# EAGLE design gameboy-pocket-custom (EAGLE 8.5.0)
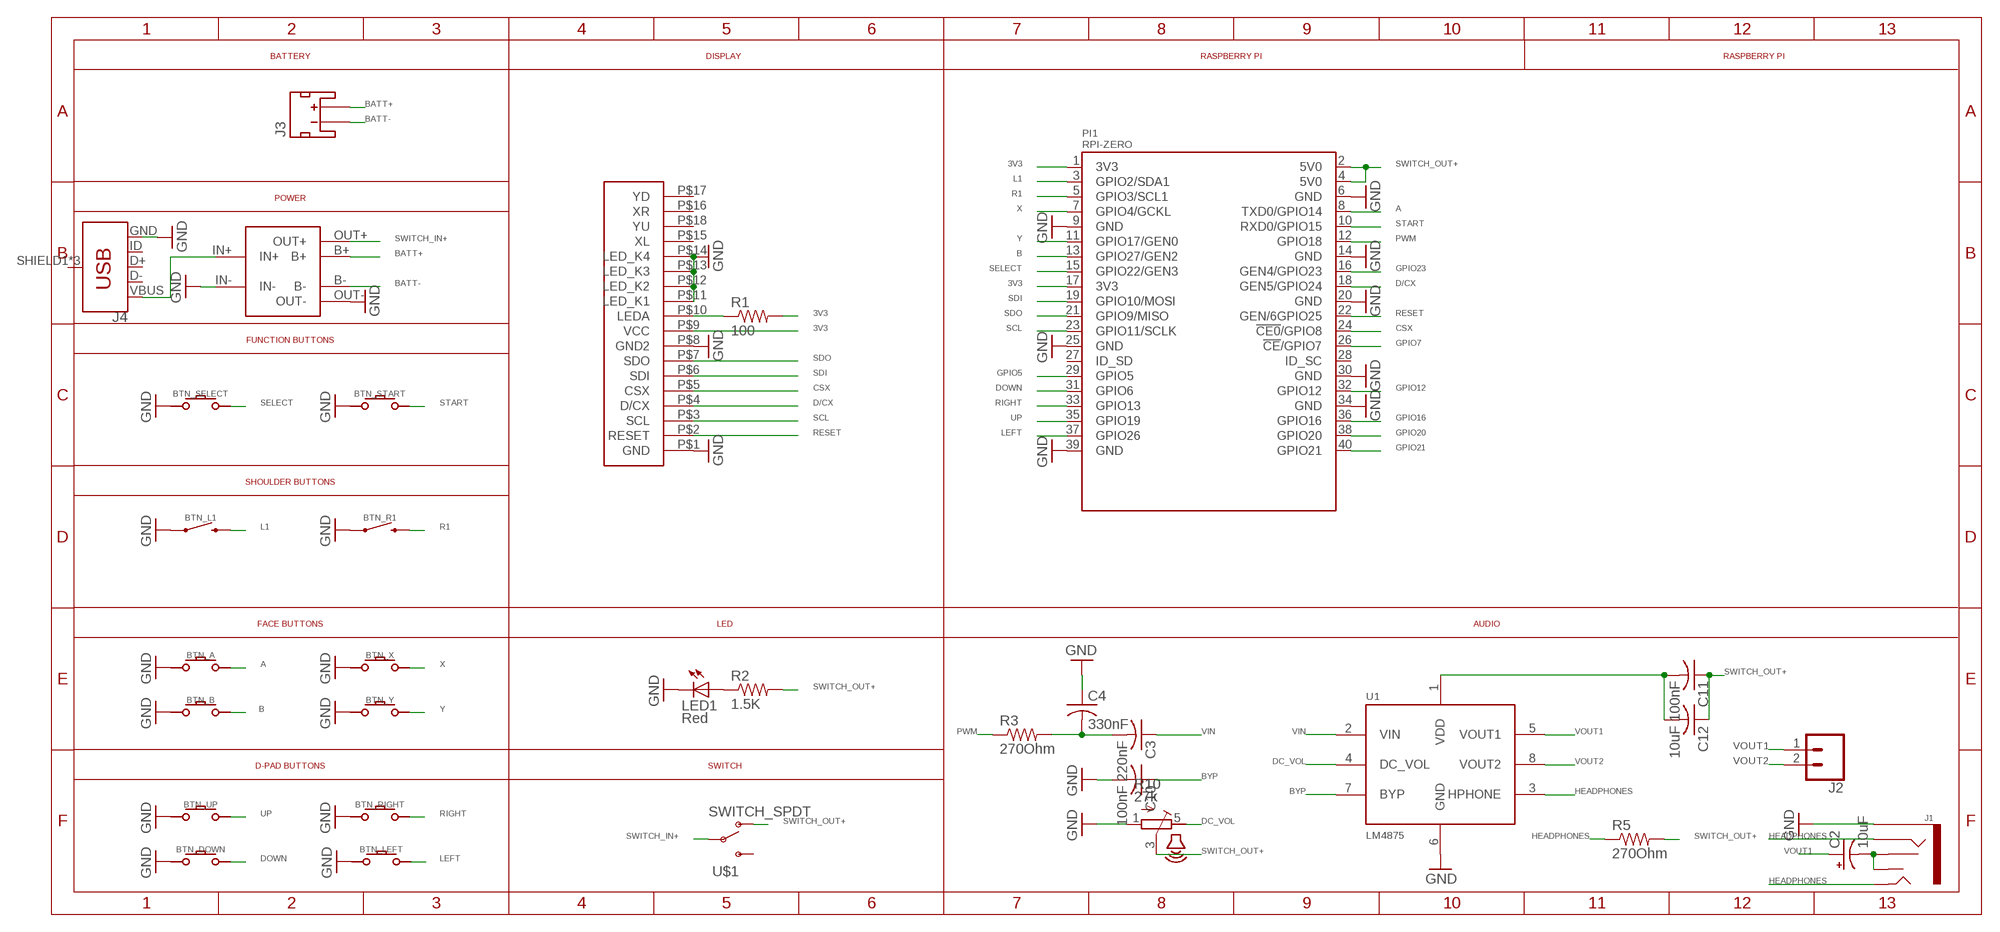
[diagram p0: schematic, sheet 1]

## Parts
BTN_A  GAMEBOY-ZERO-BUTTON  [GAMEBOY-ZERO-BUTTON]
BTN_B  GAMEBOY-ZERO-BUTTON  [GAMEBOY-ZERO-BUTTON]
BTN_DOWN  GAMEBOY-ZERO-BUTTON  [GAMEBOY-ZERO-BUTTON]
BTN_L1  MOMENTARY-SWITCH-SPST-PTH-RIGHT-ANGLE-KIT  [TACTILE_SWITCH_PTH_RIGHT_ANGLE_KIT]
BTN_LEFT  GAMEBOY-ZERO-BUTTON  [GAMEBOY-ZERO-BUTTON]
BTN_R1  MOMENTARY-SWITCH-SPST-PTH-RIGHT-ANGLE-KIT  [TACTILE_SWITCH_PTH_RIGHT_ANGLE_KIT]
BTN_RIGHT  GAMEBOY-ZERO-BUTTON  [GAMEBOY-ZERO-BUTTON]
BTN_SELECT  GAMEBOY-ZERO-BUTTON  [GAMEBOY-ZERO-BUTTON]
BTN_START  GAMEBOY-ZERO-BUTTON  [GAMEBOY-ZERO-BUTTON]
BTN_UP  GAMEBOY-ZERO-BUTTON  [GAMEBOY-ZERO-BUTTON]
BTN_X  GAMEBOY-ZERO-BUTTON  [GAMEBOY-ZERO-BUTTON]
BTN_Y  GAMEBOY-ZERO-BUTTON  [GAMEBOY-ZERO-BUTTON]
C2  10uF  10UF-POLAR-EIA3216-16V-10%(TANT)  [EIA3216]
C3  220nF  C-USC0805  [C0805]
C4  330nF  C-USC0805  [C0805]
C10  100nF  C-USC0805  [C0805]
C11  100nF  C-USC0805  [C0805]
C12  10uF  C-USC0805  [C0805]
ILI9341-TFT-2.4  GAMEBOYZEROHANDHELDDISPLAYS-3.2  [GAMEBOYZEROHANDHELDDISPLAYS-3.2]
J1  AUDIO_JACK_3.5MM_SMD  [AUDIO-JACK-3.5MM-SMD]
J2  CONN_02  [1X02]
J3  JST_2MM_MALE  [JST-2-SMD]
J4  USB_MICRO-B_FEMALE-SMT  [USB-B-MICRO-SMD]
LED1  Red  LEDCHIPLED_0805  [CHIPLED_0805]
PI1  RPI-ZERO  [RASPBERRYPI_BASTELSTUBE_V13_RASPI_BOARD_B+_FULL]
POWER1  03962A  [03962A]
R1  100  R-US_R0805  [R0805]
R2  1.5K  R-US_R0805  [R0805]
R3  270Ohm  R-US_R0805  [R0805]
R5  270Ohm  R-US_R0805  [R0805]
R10  27k  VOLUME  [VOLUME]
U1  LM4875  [SOIC8]
U$1  SWITCH_SPDT  [KPS-1290]

## Nets
3V3: ILI9341-TFT-2.4.P$9(VCC) PI1.1(3V3) PI1.17(3V3) R1.2
3V3100OHM: ILI9341-TFT-2.4.P$10(LEDA) R1.1
A: BTN_A.P$ACTIVE PI1.8(TXD0/GPIO14)
B: BTN_B.P$ACTIVE PI1.13(GPIO27/GEN2)
BATT+: J3.2(+) POWER1.B+
BATT-: J3.1(-) POWER1.B-
BYP: C10.1 U1.7(BYP)
CAP_LINE: C11.2 C12.2 U1.1(VDD)
CAP_LINE_JACK: C2.- J1.RSH J1.TSH
CSX: ILI9341-TFT-2.4.P$5(CSX) PI1.24(!CE0!/GPIO8)
D/CX: ILI9341-TFT-2.4.P$4(D/CX) PI1.18(GEN5/GPIO24)
DC_VOL: R10.5(E) U1.4(DC_VOL)
DOWN: BTN_DOWN.P$ACTIVE PI1.31(GPIO6)
GND: BTN_A.P$GND BTN_B.P$GND BTN_DOWN.P$GND BTN_L1.1 BTN_LEFT.P$GND BTN_R1.1 BTN_RIGHT.P$GND BTN_SELECT.P$GND BTN_START.P$GND BTN_UP.P$GND BTN_X.P$GND BTN_Y.P$GND C4.1 C10.2 ILI9341-TFT-2.4.P$1(GND) ILI9341-TFT-2.4.P$8(GND2) ILI9341-TFT-2.4.P$11(LED_K1) ILI9341-TFT-2.4.P$12(LED_K2) ILI9341-TFT-2.4.P$13(LED_K3) ILI9341-TFT-2.4.P$14(LED_K4) J1.SLEEVE J4.GND LED1.C PI1.6(GND) PI1.9(GND) PI1.14(GND) PI1.20(GND) PI1.25(GND) PI1.30(GND) PI1.34(GND) PI1.39(GND) POWER1.IN- POWER1.OUT- R10.1(A) U1.6(GND)
GPIO5: PI1.29(GPIO5)
GPIO7: PI1.26(!CE!/GPIO7)
GPIO12: PI1.32(GPIO12)
GPIO16: PI1.36(GPIO16)
GPIO20: PI1.38(GPIO20)
GPIO21: PI1.40(GPIO21)
GPIO23: PI1.16(GEN4/GPIO23)
HEADPHONES: J1.RING J1.TIP R5.1 U1.3(HPHONE)
L1: BTN_L1.2 PI1.3(GPIO2/SDA1)
LED: LED1.A R2.1
LEFT: BTN_LEFT.P$ACTIVE PI1.37(GPIO26)
N$2: C3.2 C4.2 R3.2
PWM: PI1.12(GPIO18) R3.1
R1: BTN_R1.2 PI1.5(GPIO3/SCL1)
RESET: ILI9341-TFT-2.4.P$2(RESET) PI1.22(GEN/6GPIO25)
RIGHT: BTN_RIGHT.P$ACTIVE PI1.33(GPIO13)
SCL: ILI9341-TFT-2.4.P$3(SCL) PI1.23(GPIO11/SCLK)
SDI: ILI9341-TFT-2.4.P$6(SDI) PI1.19(GPIO10/MOSI)
SDO: ILI9341-TFT-2.4.P$7(SDO) PI1.21(GPIO9/MISO)
SELECT: BTN_SELECT.P$ACTIVE PI1.15(GPIO22/GEN3)
START: BTN_START.P$ACTIVE PI1.10(RXD0/GPIO15)
SWITCH_IN+: POWER1.OUT+ U$1.P
SWITCH_OUT+: C11.1 C12.1 PI1.2(5V0) PI1.4(5V0) R2.2 R5.2 R10.3(S) U$1.O
UP: BTN_UP.P$ACTIVE PI1.35(GPIO19)
VIN: C3.1 U1.2(VIN)
VOUT1: C2.+ J2.1 U1.5(VOUT1)
VOUT2: J2.2 U1.8(VOUT2)
VUSB: J4.VBUS POWER1.IN+
X: BTN_X.P$ACTIVE PI1.7(GPIO4/GCKL)
Y: BTN_Y.P$ACTIVE PI1.11(GPIO17/GEN0)
Unconnected: ILI9341-TFT-2.4.P$15(XL) ILI9341-TFT-2.4.P$16(XR) ILI9341-TFT-2.4.P$17(YD) ILI9341-TFT-2.4.P$18(YU) J3.NC1(PAD1) J3.NC2(PAD2) J4.D+ J4.D- J4.ID J4.SHIELD1(SHIELD) J4.SHIELD2(SHIELD) J4.SHIELD3(SHIELD) PI1.27(ID_SD) PI1.28(ID_SC) U$1.S

## Notes on the sheet
- BATTERY | DISPLAY | RASPBERRY PI | RASPBERRY PI
- POWER
- FUNCTION BUTTONS
- SHOULDER BUTTONS
- FACE BUTTONS | LED | AUDIO
- D-PAD BUTTONS | SWITCH

## Library data of the parts
BTN_A BTN_B BTN_DOWN BTN_LEFT BTN_RIGHT BTN_SELECT BTN_START BTN_UP BTN_X BTN_Y = GameboyZeroButtonLibrary:GAMEBOY-ZERO-BUTTON
BTN_L1 BTN_R1 = SparkFun-Switches:MOMENTARY-SWITCH-SPST: Momentary Switch (Pushbutton) - SPST Normally-open (NO) SPST momentary switches (buttons, pushbuttons). Variants PTH-12MM - 12mm square, through-hole Momentary Pushbutton Switch - 12mm Square <https://www.sparkfun.com/products/9190> (COM-09190) PTH-6.0MM, PTH-6.0MM-KIT - 6.0mm square, through-hole Mini Pushbutton Switch <https://www.sparkfun.com/products/97> (COM-00097) KIT package intended for soldering kit's - only one side of pads' copper is exposed. PTH-RIGHT-ANGLE-KIT - Right-angle, through-hole Right Angle Tactile Button <https://www.sparkfun.com/products/10791> - Used on SparkFun BigTime Watch Kit <https://www.sparkfun.com/products/11734> SMD-12MM - 12mm square, surface-mount Tactile Button - SMD (12mm) <https://www.sparkfun.com/products/12993> (COM-12993) Used on SparkFun PicoBoard <https://www.sparkfun.com/products/11888> SMD-4.5MM - 4.5mm Square Trackball Switch Used on SparkFun Blackberry Trackballer Breakout <https://www.sparkfun.com/products/13169> SMD-4.6MMX2.8MM - 4.60mm x 2.80mm, surface mount Used on SparkFun SAMD21 Mini Breakout <https://www.sparkfun.com/products/13664> SMD-5.2MM, SMD-5.2-REDUNDANT - 5.2mm square, surface-mount Mini Pushbutton Switch - SMD <https://www.sparkfun.com/products/8720> (COM-08720) Used on Arduino Pro Mini <https://www.sparkfun.com/products/11114> REDUNDANT package connects both switch circuits together SMD-6.0X3.5MM - 6.0 x 3.5mm, surface mount Momentary Reset Switch SMD <https://www.sparkfun.com/products/8229> (COM-08229) SMD-6.2MM-TALL - 6.2mm square, surface mount Tactile Button - SMD (6mm) <https://www.sparkfun.com/products/12992> Used on SparkFun Digital Sandbox <https://www.sparkfun.com/products/12651> SMD-RIGHT-ANGLE - Right-angle, surface mount Used on SparkFun Block for Intel® Edison - Arduino <https://www.sparkfun.com/products/13036>; PROD_ID: CONN-10672; SF_SKU: COM-10791
C2 = SparkFun-Capacitors:10UF-POLAR: 10.0µF polarized capacitors A capacitor is a passive two-terminal electrical component used to store electrical energy temporarily in an electric field.; PROD_ID: CAP-00811
C3 C4 C10-C12 = adafruit:C-US: CAPACITOR, American symbol
ILI9341-TFT-2.4 = GameboyZeroHandheldDisplays:GAMEBOYZEROHANDHELDDISPLAYS-3.2
J1 = SparkFun-Connectors:AUDIO_JACK_3.5MM: Audio Jack 3.5mm variants of PTH and SMT stereo audio jack with bypass switches. SparkFun Products: SparkFun SparkPunk Sound Kit <[https://www.sparkfun.com/products/11177]> - PTH MP3 Trigger <https://www.sparkfun.com/products/13720> -3.5mm SMD SparkFun PicoBoard <https://www.sparkfun.com/products/11888>- 2.5mm SMD; PROD_ID: CONN-10353
J2 = SparkFun-Connectors:CONN_02: Multi connection point. Often used as Generic Header-pin footprint for 0.1 inch spaced/style header connections On any of the 0.1 inch spaced packages, you can populate with these: Break Away Headers - Straight <https://www.sparkfun.com/products/116> (PRT-00116) Break Away Male Headers - Right Angle <https://www.sparkfun.com/products/553> (PRT-00553) Female Headers <https://www.sparkfun.com/products/115> (PRT-00115) Break Away Headers - Machine Pin <https://www.sparkfun.com/products/117> (PRT-00117) Break Away Female Headers - Swiss Machine Pin <https://www.sparkfun.com/products/743> (PRT-00743) For SCREWTERMINALS and SPRING TERMINALS visit here: Screw Terimnals on SparkFun.com <https://www.sparkfun.com/search/results?term=Screw+Terminals> (5mm/3.5mm/2.54mm spacing) This device is also useful as a general connection point to wire up your design to another part of your project. Our various solder wires solder well into these plated through hole pads. Hook-Up Wire - Assortment (Stranded, 22 AWG) <https://www.sparkfun.com/products/11375> (PRT-11375) Hook-Up Wire - Assortment (Solid Core, 22 AWG) <https://www.sparkfun.com/products/11367> (PRT-11367) View the entire wire category on our website here <https://www.sparkfun.com/categories/141> Special notes: Molex polarized connector foot print use with: PRT-08233 with associated crimp pins and housings. 2.54_SCREWTERM for use with PRT-10571. 3.5mm Screw Terminal footprints for PRT-08084 5mm Screw Terminal footprints for use with PRT-08432
J3 = SparkFun-Connectors:JST_2MM_MALE: Mates to single-cell LiPo batteries. CONN-11443 Now with smashable polarity marks!; BTM_NEG: -; BTM_POS: +; PROD_ID: CONN-11443; TOP_NEG: -; TOP_POS: +
J4 = SparkFun-Connectors:USB_MICRO-B: USB Type Micro-B Connector Male/female and PTH/SMT variants SparkFun Products: SparkFun microB USB Breakout <https://www.sparkfun.com/products/12035> SparkFun USB microB Plug Breakout <https://www.sparkfun.com/products/10031> SparkFun ESP8266 Thing <https://www.sparkfun.com/products/13231>; PROD_ID: CONN-11752
LED1 = adafruit:LED: LED OSRAM: - CHIPLED LG R971, LG N971, LY N971, LG Q971, LY Q971, LO R971, LY R971 LH N974, LH R974 LS Q976, LO Q976, LY Q976 LO Q996 - Hyper CHIPLED LW Q18S LB Q993, LB Q99A, LB R99A - SideLED LS A670, LO A670, LY A670, LG A670, LP A670 LB A673, LV A673, LT A673, LW A673 LH A674 LY A675 LS A676, LA A676, LO A676, LY A676, LW A676 LS A679, LY A679, LG A679 - Hyper Micro SIDELED® LS Y876, LA Y876, LO Y876, LY Y876 LT Y87S - SmartLED LW L88C, LW L88S LB L89C, LB L89S, LG L890 LS L89K, LO L89K, LY L89K LS L896, LA L896, LO L896, LY L896 - TOPLED LS T670, LO T670, LY T670, LG T670, LP T670 LSG T670, LSP T670, LSY T670, LOP T670, LYG T670 LG T671, LOG T671, LSG T671 LB T673, LV T673, LT T673, LW T673 LH T674 LS T676, LA T676, LO T676, LY T676, LB T676, LH T676, LSB T676, LW T676 LB T67C, LV T67C, LT T67C, LS T67K, LO T67K, LY T67K, LW E67C LS E67B, LA E67B, LO E67B, LY E67B, LB E67C, LV E67C, LT E67C LW T67C LS T679, LY T679, LG T679 LS T770, LO T770, LY T770, LG T770, LP T770 LB T773, LV T773, LT T773, LW T773 LH T774 LS E675, LA E675, LY E675, LS T675 LS T776, LA T776, LO T776, LY T776, LB T776 LHGB T686 LT T68C, LB T68C - Hyper Mini TOPLED® LB M676 - Mini TOPLED Santana® LG M470 LS M47K, LO M47K, LY M47K Source: http://www.osram.convergy.de/
PI1 = RPI-Zero:RPI-ZERO
POWER1 = 03962A:03962A
R1-R3 R5 = adafruit:R-US_: RESISTOR, American symbol
R10 = GBA:VOLUME
U1 = texas:LM4875
U$1 = SparkFun-Retired:SWITCH_SPDT: SWCH-10651 Side-actuated SPDT slide switch, as used on the Arduino Pro; PROD_ID: SWCH-10651

## Board
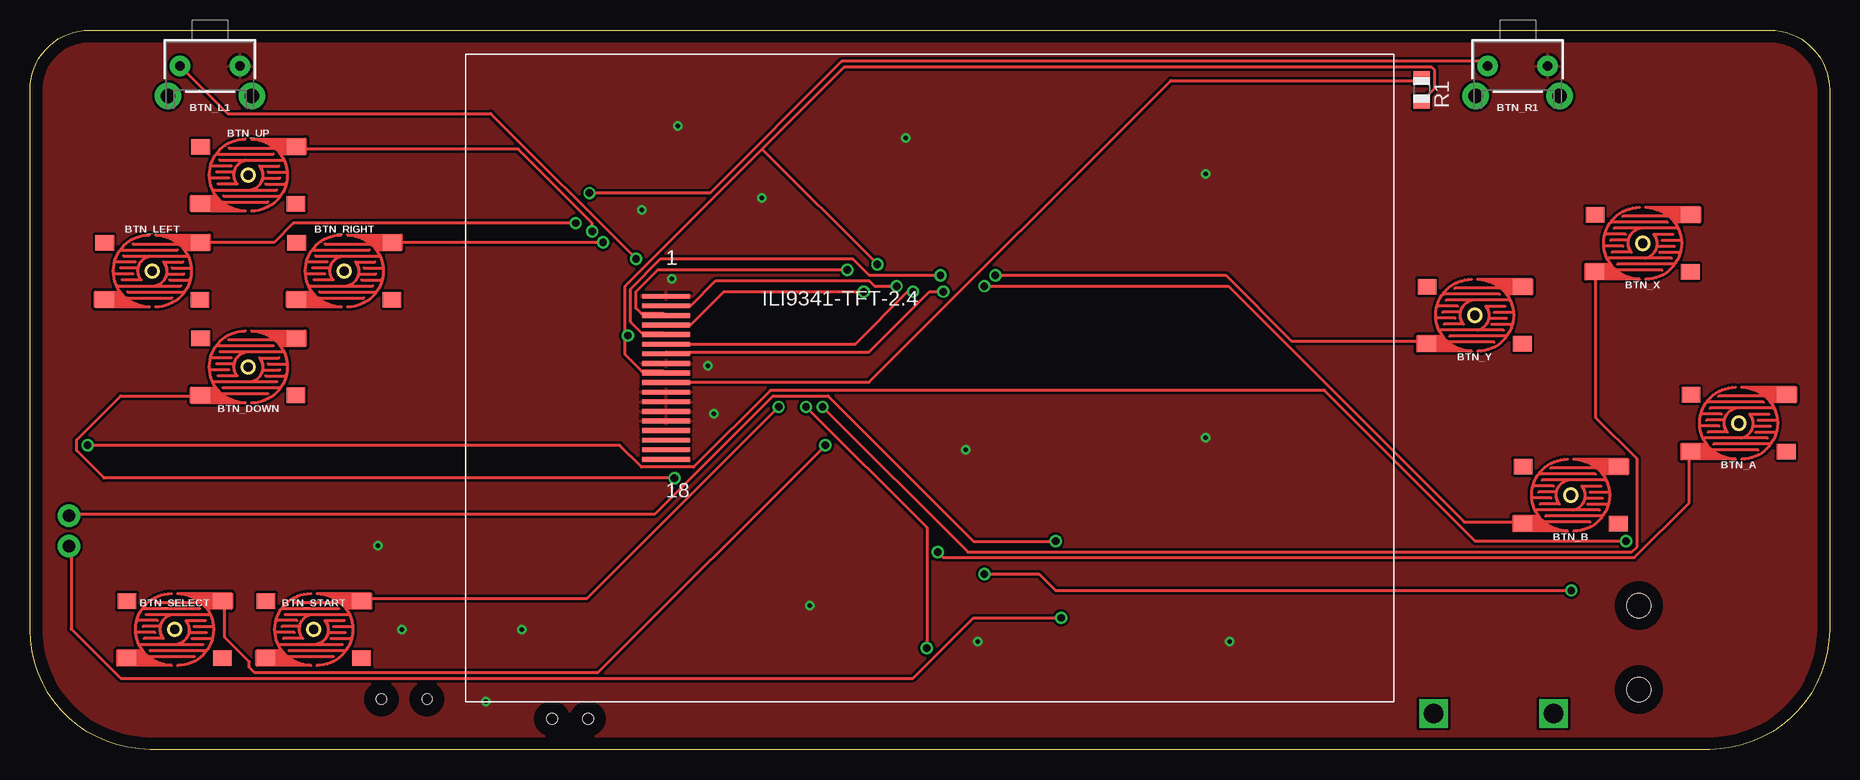
[diagram p1: board, top side]
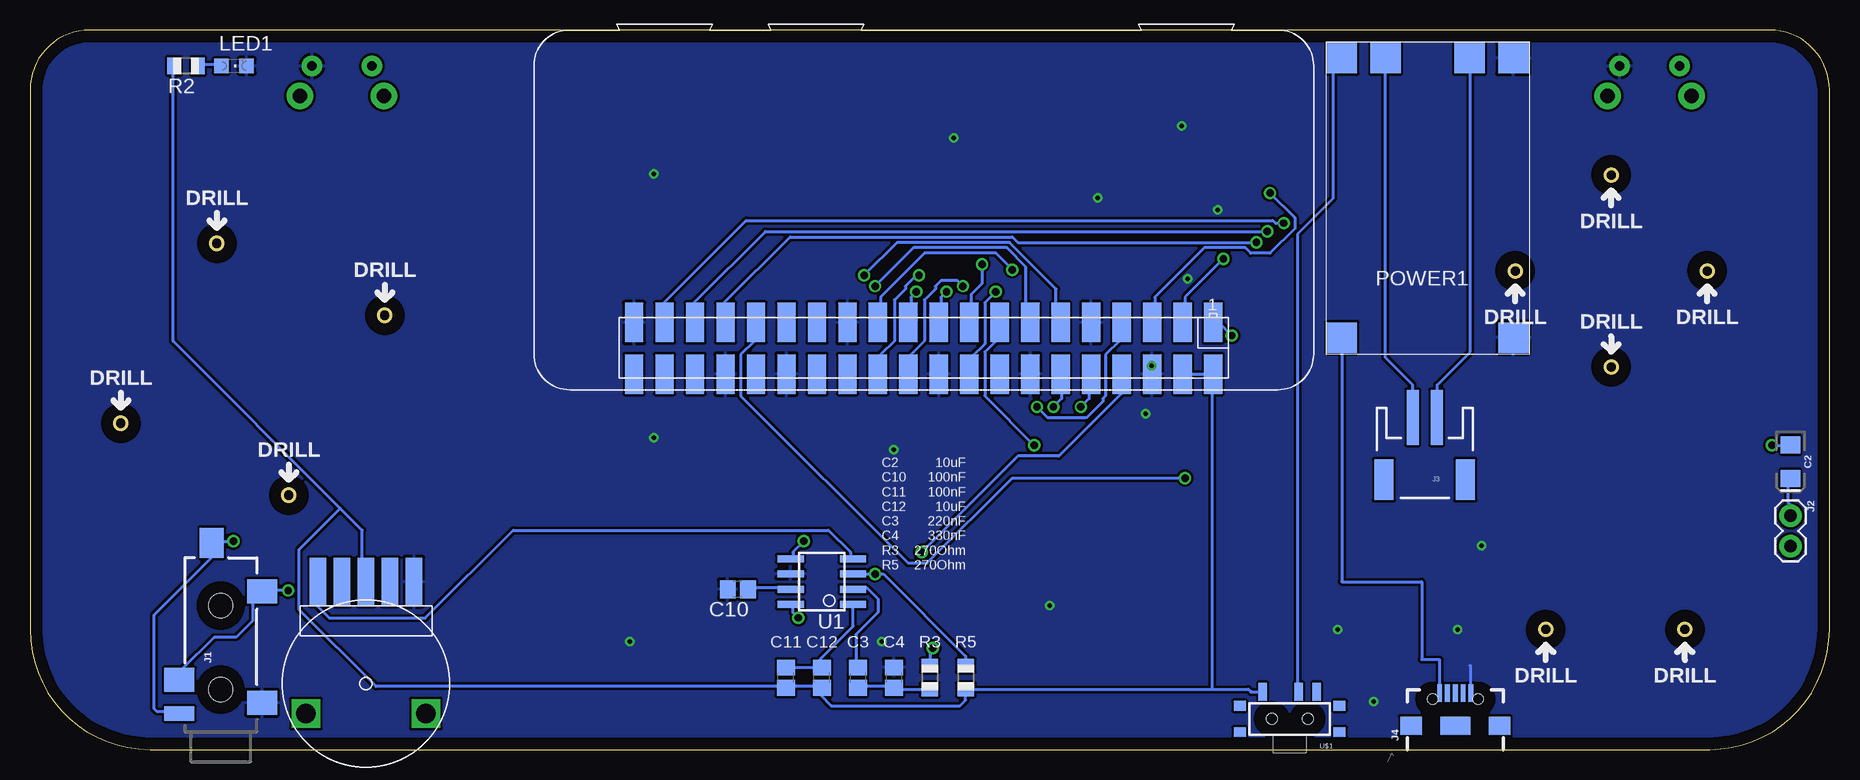
[diagram p2: board, bottom side, seen from below]

Size 150 x 60 mm. Coordinates in mm from the lower left corner, seen from the top.
Outline: 5,60 145,60 arc-90 150,55 150,10 arc-90 140,0 10,0 arc-90 0,10 0,55 arc-90 5,60
Copper layers (1*16): Top 0.035mm / dielectric 1.5mm / Bottom 0.035mm
Design rules "default": minimum track width 10mil, minimum drill 24mil, track to track 8mil, track to pad 8mil, pad to pad 8mil, via to via 8mil, smd to smd 8mil, copper to edge 40mil, drill to drill 8mil, minimum pad ring 10mil, minimum via ring 8mil, stop-mask expansion 4mil, vias tented up to drill 0mil, thermal gap 10mil

### Footprints (pad centres in the part's own frame; a part is rotated, then mirrored left to right if it is on the bottom)
GAMEBOY-ZERO-BUTTON = smd 1.55 x 1.3: P$ACTIVE 3.975,2.365; P$GND -3.975,-2.385; P$NC -3.975,2.365; P$NC2 3.975,-2.385 | hole 1: 0,0
TACTILE_SWITCH_PTH_RIGHT_ANGLE_KIT = drill 0.8 pad 1.7: 1 -2.5,0; 2 2.5,0 | drill 1.2 pad 2.2: ANCHOR1 -3.5,2.5; ANCHOR2 3.5,2.5
EIA3216 = smd 1.4 x 1.6: + 1.4,0; - -1.4,0
C0805 = smd 1.3 x 1.5: 1 -0.85,0; 2 0.85,0
GAMEBOYZEROHANDHELDDISPLAYS-3.2 = smd 4 x 0.4: P$1 -22,6.8; P$2 -22,6; P$3 -22,5.2; P$4 -22,4.4; P$5 -22,3.6; P$6 -22,2.8; P$7 -22,2; P$8 -22,1.2; P$9 -22,0.4; P$10 -22,-0.4; P$11 -22,-1.2; P$12 -22,-2; P$13 -22,-2.8; P$14 -22,-3.6; P$15 -22,-4.4; P$16 -22,-5.2; P$17 -22,-6; P$18 -22,-6.8
AUDIO-JACK-3.5MM-SMD = smd 2 x 2.5: RING 4.3,3.45; SLEEVE 2.4,-3.45; TIP 11.7,-3.45 | smd 1.2 x 2.5: RSH 1.5,3.45 | smd 2.5 x 2: TSH 15.75,0.75 | hole 2: 3.5,0; 10.5,0
1X02 = drill 1.016 pad 1.88: 1 0,0; 2 2.54,0
JST-2-SMD = smd 1 x 4.6: 1 -1,-3.7; 2 1,-3.7 | smd 1.6 x 3.4: NC1 -3.4,1.5; NC2 3.4,1.5
USB-B-MICRO-SMD = smd 1.45 x 0.4: D+ 2.725,0; D- 2.725,0.65; GND 2.725,-1.3; ID 2.725,-0.65; VBUS 2.725,1.3 | smd 1.5 x 1.8: SHIELD1 0,3.685; SHIELD2 0,-3.685 | smd 1.5 x 2.5: SHIELD3 0,0 | hole 0.85: 2.2,1.9; 2.2,-1.9
CHIPLED_0805 = smd 1.2 x 1.2: A 0,-1.05; C 0,1.05
RASPBERRYPI_BASTELSTUBE_V13_RASPI_BOARD_B+_FULL = smd 1.524 x 3.302: 1 8.382,24.384; 2 8.382,28.702; 3 10.922,24.384; 4 10.922,28.702; 5 13.462,24.384; 6 13.462,28.702; 7 16.002,24.384; 8 16.002,28.702; 9 18.542,24.384; 10 18.542,28.702; 11 21.082,24.384; 12 21.082,28.702; 13 23.622,24.384; 14 23.622,28.702; 15 26.162,24.384; 16 26.162,28.702; 17 28.702,24.384; 18 28.702,28.702; 19 31.242,24.384; 20 31.242,28.702; 21 33.782,24.384; 22 33.782,28.702; 23 36.322,24.384; 24 36.322,28.702; 25 38.862,24.384; 26 38.862,28.702; 27 41.402,24.384; 28 41.402,28.702; 29 43.942,24.384; 30 43.942,28.702; 31 46.482,24.384; 32 46.482,28.702; 33 49.022,24.384; 34 49.022,28.702; 35 51.562,24.384; 36 51.562,28.702; 37 54.102,24.384; 38 54.102,28.702; 39 56.642,24.384; 40 56.642,28.702
03962A = smd 2.54 x 2.54: B+ 12,1.35; B- 5,1.35; IN+ 15.65,24.65; IN- 1.35,24.65; OUT+ 15.65,1.35; OUT- 1.35,1.35
R0805 = smd 1.1 x 1.4: 1 -1,0; 2 1,0
VOLUME = smd 1.4 x 4: 1 -4,-2; 2 -2,-2; 3 0,-2; 4 2,-2; 5 4,-2 | drill 1.6 square: P$6 -5,9; P$7 5,9
SOIC8 = smd 0.6 x 2.2: 1 -1.905,-2.6; 2 -0.635,-2.6; 3 0.635,-2.6; 4 1.905,-2.6; 5 1.905,2.6; 6 0.635,2.6; 7 -0.635,2.6; 8 -1.905,2.6
KPS-1290 = smd 0.7 x 1.5: O -2.25,2.25; P 0.75,2.25; S 2.25,2.25 | smd 1 x 0.8: P$1 -4.15,1.1; P$2 -4.15,-1.1; P$3 4.15,-1.1; P$4 4.15,1.1 | hole 0.9: -1.5,0; 1.5,0

### Placement (x,y rotation side)
BTN_A  142.42,27.21 180 top
BTN_B  128.42,21.21 180 top
BTN_DOWN  18.2,31.9 180 top
BTN_L1  15,57 180 top
BTN_LEFT  10.2,39.9 0 top
BTN_R1  124,57 180 top
BTN_RIGHT  26.2,39.9 0 top
BTN_SELECT  12.05,10.01 0 top
BTN_START  23.66,10.01 0 top
BTN_UP  18.2,47.9 0 top
BTN_X  134.42,42.21 180 top
BTN_Y  120.42,36.21 180 top
C2  3.25,24 270 bottom
C3  81,6 270 bottom
C4  78,6 270 bottom
C10  91,13.37 180 bottom
C11  87,6 90 bottom
C12  84,6 90 bottom
ILI9341-TFT-2.4  75,31 0 top
J1  134.1,1.5 90 bottom
J2  3.25,19.5 270 bottom
J3  33.75,24 180 bottom
J4  31.2,2 90 bottom
LED1  133,57 270 bottom
PI1  43,60 180 bottom
POWER1  25,59 180 bottom
R1  116,55 270 top
R2  137,57 180 bottom
R3  75,6 270 bottom
R5  72,6 270 bottom
R10  122,12 180 bottom
U1  84,14 90 bottom
U$1  45,2.55 0 bottom

### Tracks (layer width: path | path; a pad name or v marks a point on that pad's centre or on a via)
3V3  (via drill 0.61)
  Top 0.254: 61.04,50.06 49.61,38.63 49.61,34.52 | 61.04,50.06 67.89,56.92 116.81,56.92 117.04,56.69 117.04,55.09 116.13,54.18 R1.2 | 49.61,34.52 49.61,32.92 50.98,31.55 52.81,31.55 ILI9341-TFT-2.4.P$9 | 49.61,34.52 v49.84,34.52 | 61.04,50.06 v70.64,40.46
  Bottom 0.254: v49.84,34.52 50.75,35.43 51.21,35.43 PI1.1 | v70.64,40.46 70.64,38.86 71.55,37.95 71.55,35.66 PI1.17
3V3100OHM
  Top 0.254: R1.1 115.9,55.78 95.1,55.78 69.95,30.63 53.03,30.63 ILI9341-TFT-2.4.P$10
A  (via drill 0.61)
  Top 0.254: v75.67,16.46 76.12,16 133.73,16 138.3,20.57 138.3,24.69 BTN_A.P$ACTIVE
  Bottom 0.254: v75.67,16.46 67.67,24.46 64.24,24.46 58.98,29.72 58.98,31.09 PI1.8
B  (via drill 0.61)
  Top 0.254: v79.55,38.63 99.9,38.63 119.56,18.97 124.36,18.97 BTN_B.P$ACTIVE
  Bottom 0.254: v79.55,38.63 76.35,41.83 68.58,41.83 66.98,40.23 66.98,35.89 66.75,35.66 PI1.13
BATT+
  Bottom 0.254: POWER1.B+ 37.03,57.61 37.03,32.69 34.75,30.4 34.75,27.89 J3.2
BATT-
  Bottom 0.254: POWER1.B- 29.95,57.61 29.95,33.15 32.69,30.4 32.69,27.89 J3.1
BYP
  Bottom 0.254: C10.1 90.07,13.49 86.64,13.49 U1.7
CAP_LINE
  Bottom 0.254: 84.12,6.86 86.87,6.86 C11.2 | 84.12,6.86 84.12,7.54 81.38,10.29 81.38,11.89 U1.1 | 84.12,6.86 C12.2
CAP_LINE_JACK  (via drill 0.61)
  Top 0.254: v4.8,25.38 49.15,25.38 50.98,23.55 55.32,23.55 61.72,29.95 107.9,29.95 120.47,17.37 v133.04,17.37
  Bottom 0.254: v4.8,25.38 3.43,25.38 C2.- | v133.04,17.37 134.65,17.37 J1.TSH 134.87,17.14 134.87,16 139.68,11.2 139.68,3.43 139.45,3.2 137.62,3.2 J1.RSH
CSX  (via drill 0.61)
  Top 0.254: v75.89,39.55 69.95,39.55 68.58,40.92 52.58,40.92 50.06,38.41 50.06,35.66 50.98,34.75 52.81,34.75 ILI9341-TFT-2.4.P$5
  Bottom 0.254: v75.89,39.55 76.12,39.55 77.04,38.63 77.04,38.41 77.95,37.49 77.95,34.06 79.1,32.92 79.1,31.32 PI1.24
D/CX  (via drill 0.61)
  Top 0.254: v69.49,38.18 57.84,38.18 55.09,35.43 53.03,35.43 ILI9341-TFT-2.4.P$4
  Bottom 0.254: v69.49,38.18 70.41,37.26 70.41,33.83 71.55,32.69 71.55,31.32 PI1.18
DC_VOL
  Bottom 0.254: U1.4 81.61,16 81.61,16.46 83.44,18.29 109.73,18.29 117.04,10.97 125.04,10.97 126.19,12.12 126.19,13.95 R10.5
DOWN  (via drill 0.61)
  Top 0.254: v53.72,22.63 6.17,22.63 3.89,24.92 3.89,25.83 7.54,29.49 14.17,29.49 BTN_DOWN.P$ACTIVE
  Bottom 0.254: v53.72,22.63 68.12,22.63 75.21,15.54 76.81,15.54 90.75,29.49 90.75,32.92 89.61,34.06 89.61,35.43 PI1.31
GND  (via drill 0.35)
  Bottom 0.254: J4.GND 29.9,7 30,7
  other vias: 54,52 73,51 98,48 98,26 65,12 41,10 31,10 29,17 100,9 79,9 38,4 61,46 51,45 78,25 53.5,39.25 57,28 56.5,32
  pour Bottom: 0,0 0,60 150,60 150,0
  pour Top: 0,60 0,0 150,0 150,60
HEADPHONES  (via drill 0.61)
  Top 0.254: v128.47,13.26 85.5,13.26 84.12,14.63 v79.55,14.63
  Bottom 0.254: J1.RING 137.39,5.94 137.39,6.63 134.65,9.37 132.82,9.37 131.44,10.74 131.44,12.34 130.76,13.03 J1.TIP 130.53,13.26 v128.47,13.26 | R5.1 72.01,7.09 72.01,7.77 78.87,14.63 v79.55,14.63 81.38,14.63 U1.3
L1  (via drill 0.61)
  Top 0.254: v50.52,40.92 38.41,53.03 16.46,53.03 12.57,56.92 BTN_L1.2
  Bottom 0.254: v50.52,40.92 53.72,37.72 53.72,35.66 PI1.3
LED
  Bottom 0.254: LED1.A 134.19,57.15 135.79,57.15 R2.1
LEFT  (via drill 0.61)
  Top 0.254: v45.49,43.89 21.95,43.89 20.34,42.29 14.4,42.29 BTN_LEFT.P$ACTIVE
  Bottom 0.254: v45.49,43.89 46.18,43.89 46.41,44.12 90.3,44.12 97.16,37.26 97.16,35.66 PI1.37
N$2
  Bottom 0.254: R3.2 75.21,5.03 77.95,5.03 C4.2 78.18,5.26 80.92,5.26 C3.2
PWM  (via drill 0.61)
  Top 0.254: v74.75,8.46 74.75,18.52 v64.69,28.57
  Bottom 0.254: v74.75,8.46 74.98,8.23 74.98,7.09 R3.1 | v64.69,28.57 64.01,29.26 64.01,31.09 PI1.12
R1  (via drill 0.61)
  Top 0.254: v46.63,46.41 56.69,46.41 67.67,57.38 121.16,57.38 121.39,57.15 BTN_R1.2
  Bottom 0.254: v46.63,46.41 44.58,44.35 44.58,43.43 46.63,41.38 48.23,41.38 48.69,41.83 52.12,41.83 56.24,37.72 56.24,35.66 PI1.5
RESET  (via drill 0.61)
  Top 0.254: v72.24,38.63 70.41,38.63 69.95,39.09 57.15,39.09 55.09,37.03 53.03,37.03 ILI9341-TFT-2.4.P$2
  Bottom 0.254: v72.24,38.63 72.69,39.09 74.07,39.09 74.52,38.63 74.52,38.41 75.44,37.49 75.44,34.06 76.58,32.92 76.58,31.32 PI1.22
RIGHT  (via drill 0.61)
  Top 0.254: v47.78,42.29 30.18,42.29 BTN_RIGHT.P$ACTIVE
  Bottom 0.254: v47.78,42.29 67.67,42.29 68.12,42.75 86.64,42.75 92.13,37.26 92.13,35.66 PI1.33
SCL  (via drill 0.61)
  Top 0.254: v68.12,40.01 52.35,40.01 50.52,38.18 50.52,36.8 50.98,36.35 52.81,36.35 ILI9341-TFT-2.4.P$3
  Bottom 0.254: v68.12,40.01 69.49,41.38 75.44,41.38 79.1,37.72 79.1,35.66 PI1.23
SDI  (via drill 0.61)
  Top 0.254: v73.61,38.18 73.15,38.18 68.81,33.83 53.03,33.83 ILI9341-TFT-2.4.P$6
  Bottom 0.254: v73.61,38.18 74.07,37.72 74.07,35.66 PI1.19
SDO  (via drill 0.61)
  Top 0.254: v76.12,38.18 74.98,38.18 69.95,33.15 53.03,33.15 ILI9341-TFT-2.4.P$7
  Bottom 0.254: v76.12,38.18 76.58,37.72 76.58,35.66 PI1.21
SELECT  (via drill 0.61)
  Top 0.254: v66.29,25.38 47.32,6.4 18.75,6.4 18.29,6.86 18.29,7.32 16.23,9.37 16.23,12.34 BTN_SELECT.P$ACTIVE
  Bottom 0.254: v66.29,25.38 70.41,29.49 70.41,33.15 69.27,34.29 69.27,35.43 PI1.15
START  (via drill 0.61)
  Top 0.254: v62.41,28.57 46.41,12.57 27.66,12.57 BTN_START.P$ACTIVE
  Bottom 0.254: v62.41,28.57 61.72,29.26 61.72,31.09 PI1.10
SWITCH_IN+
  Bottom 0.254: U$1.P 44.35,4.8 44.35,42.98 41.38,45.95 41.38,56.92 40.69,57.61 POWER1.OUT+
SWITCH_OUT+
  Bottom 0.254: 124.13,20.12 122.3,18.29 122.3,14.4 122.07,14.17 R10.3 | 124.13,20.12 138.07,34.06 138.07,56.92 R2.2 | PI1.4 53.72,31.32 51.44,31.32 PI1.2 51.44,31.09 51.44,5.03 | 51.44,5.03 71.78,5.03 R5.2 72.01,4.8 72.01,4.12 72.47,3.66 83.21,3.66 84.12,4.57 84.12,5.03 C12.1 84.12,5.26 86.87,5.26 C11.1 87.1,5.26 121.16,5.26 127.56,11.66 127.56,16.69 124.13,20.12 | 51.44,5.03 48.46,5.03 48.23,4.8 47.32,4.8 U$1.O
UP  (via drill 0.61)
  Top 0.254: v46.86,43.2 46.86,43.89 40.69,50.06 22.4,50.06 BTN_UP.P$ACTIVE
  Bottom 0.254: v46.86,43.2 88.7,43.2 94.64,37.26 94.64,35.66 PI1.35
VIN
  Bottom 0.254: C3.1 81.15,6.86 81.15,9.6 79.32,11.43 79.32,12.57 80.24,13.49 81.38,13.49 U1.2
VOUT1  (via drill 0.61)
  Top 0.254: v85.5,17.37 78.64,17.37 66.52,29.49 61.95,29.49 52.12,19.66 3.43,19.66 J2.1
  Bottom 0.254: C2.+ 3.43,22.4 3.43,20.57 3.2,20.34 3.2,19.66 J2.1 | v85.5,17.37 86.41,16.46 86.41,16 U1.5
VOUT2  (via drill 0.61)
  Top 0.254: v85.95,10.97 78.64,10.97 73.61,5.94 7.54,5.94 3.43,10.06 3.43,16.92 J2.2
  Bottom 0.254: v85.95,10.97 86.41,11.43 86.41,11.89 U1.8
VUSB
  Bottom 0.254: POWER1.IN+ 40.65,14 34,14 34,7.5 32.5,7.5 J4.VBUS
X  (via drill 0.61)
  Top 0.254: v66.06,28.57 78.18,16.46 133.5,16.46 133.96,16.92 133.96,24.23 130.53,27.66 130.53,39.78 BTN_X.P$ACTIVE
  Bottom 0.254: v66.06,28.57 65.15,27.66 61.95,27.66 60.58,29.03 60.58,29.26 60.35,29.49 60.35,32.92 59.21,34.06 59.21,35.43 PI1.7
Y  (via drill 0.61)
  Top 0.254: v80.47,39.55 99.67,39.55 105.16,34.06 116.36,34.06 BTN_Y.P$ACTIVE
  Bottom 0.254: v80.47,39.55 77.72,42.29 68.35,42.29 64.47,38.41 64.47,35.89 64.24,35.66 PI1.11

### Text on the board
bNames: 10uF / 100nF / 100nF / 10uF / 220nF / 330nF / 270Ohm / 270Ohm | C2 / C10 / C11 / C12 / C3 / C4 / R3 / R5